# EasyEDA Pro project 第十届农装PCB工程.epro, board 主控板_2024_8
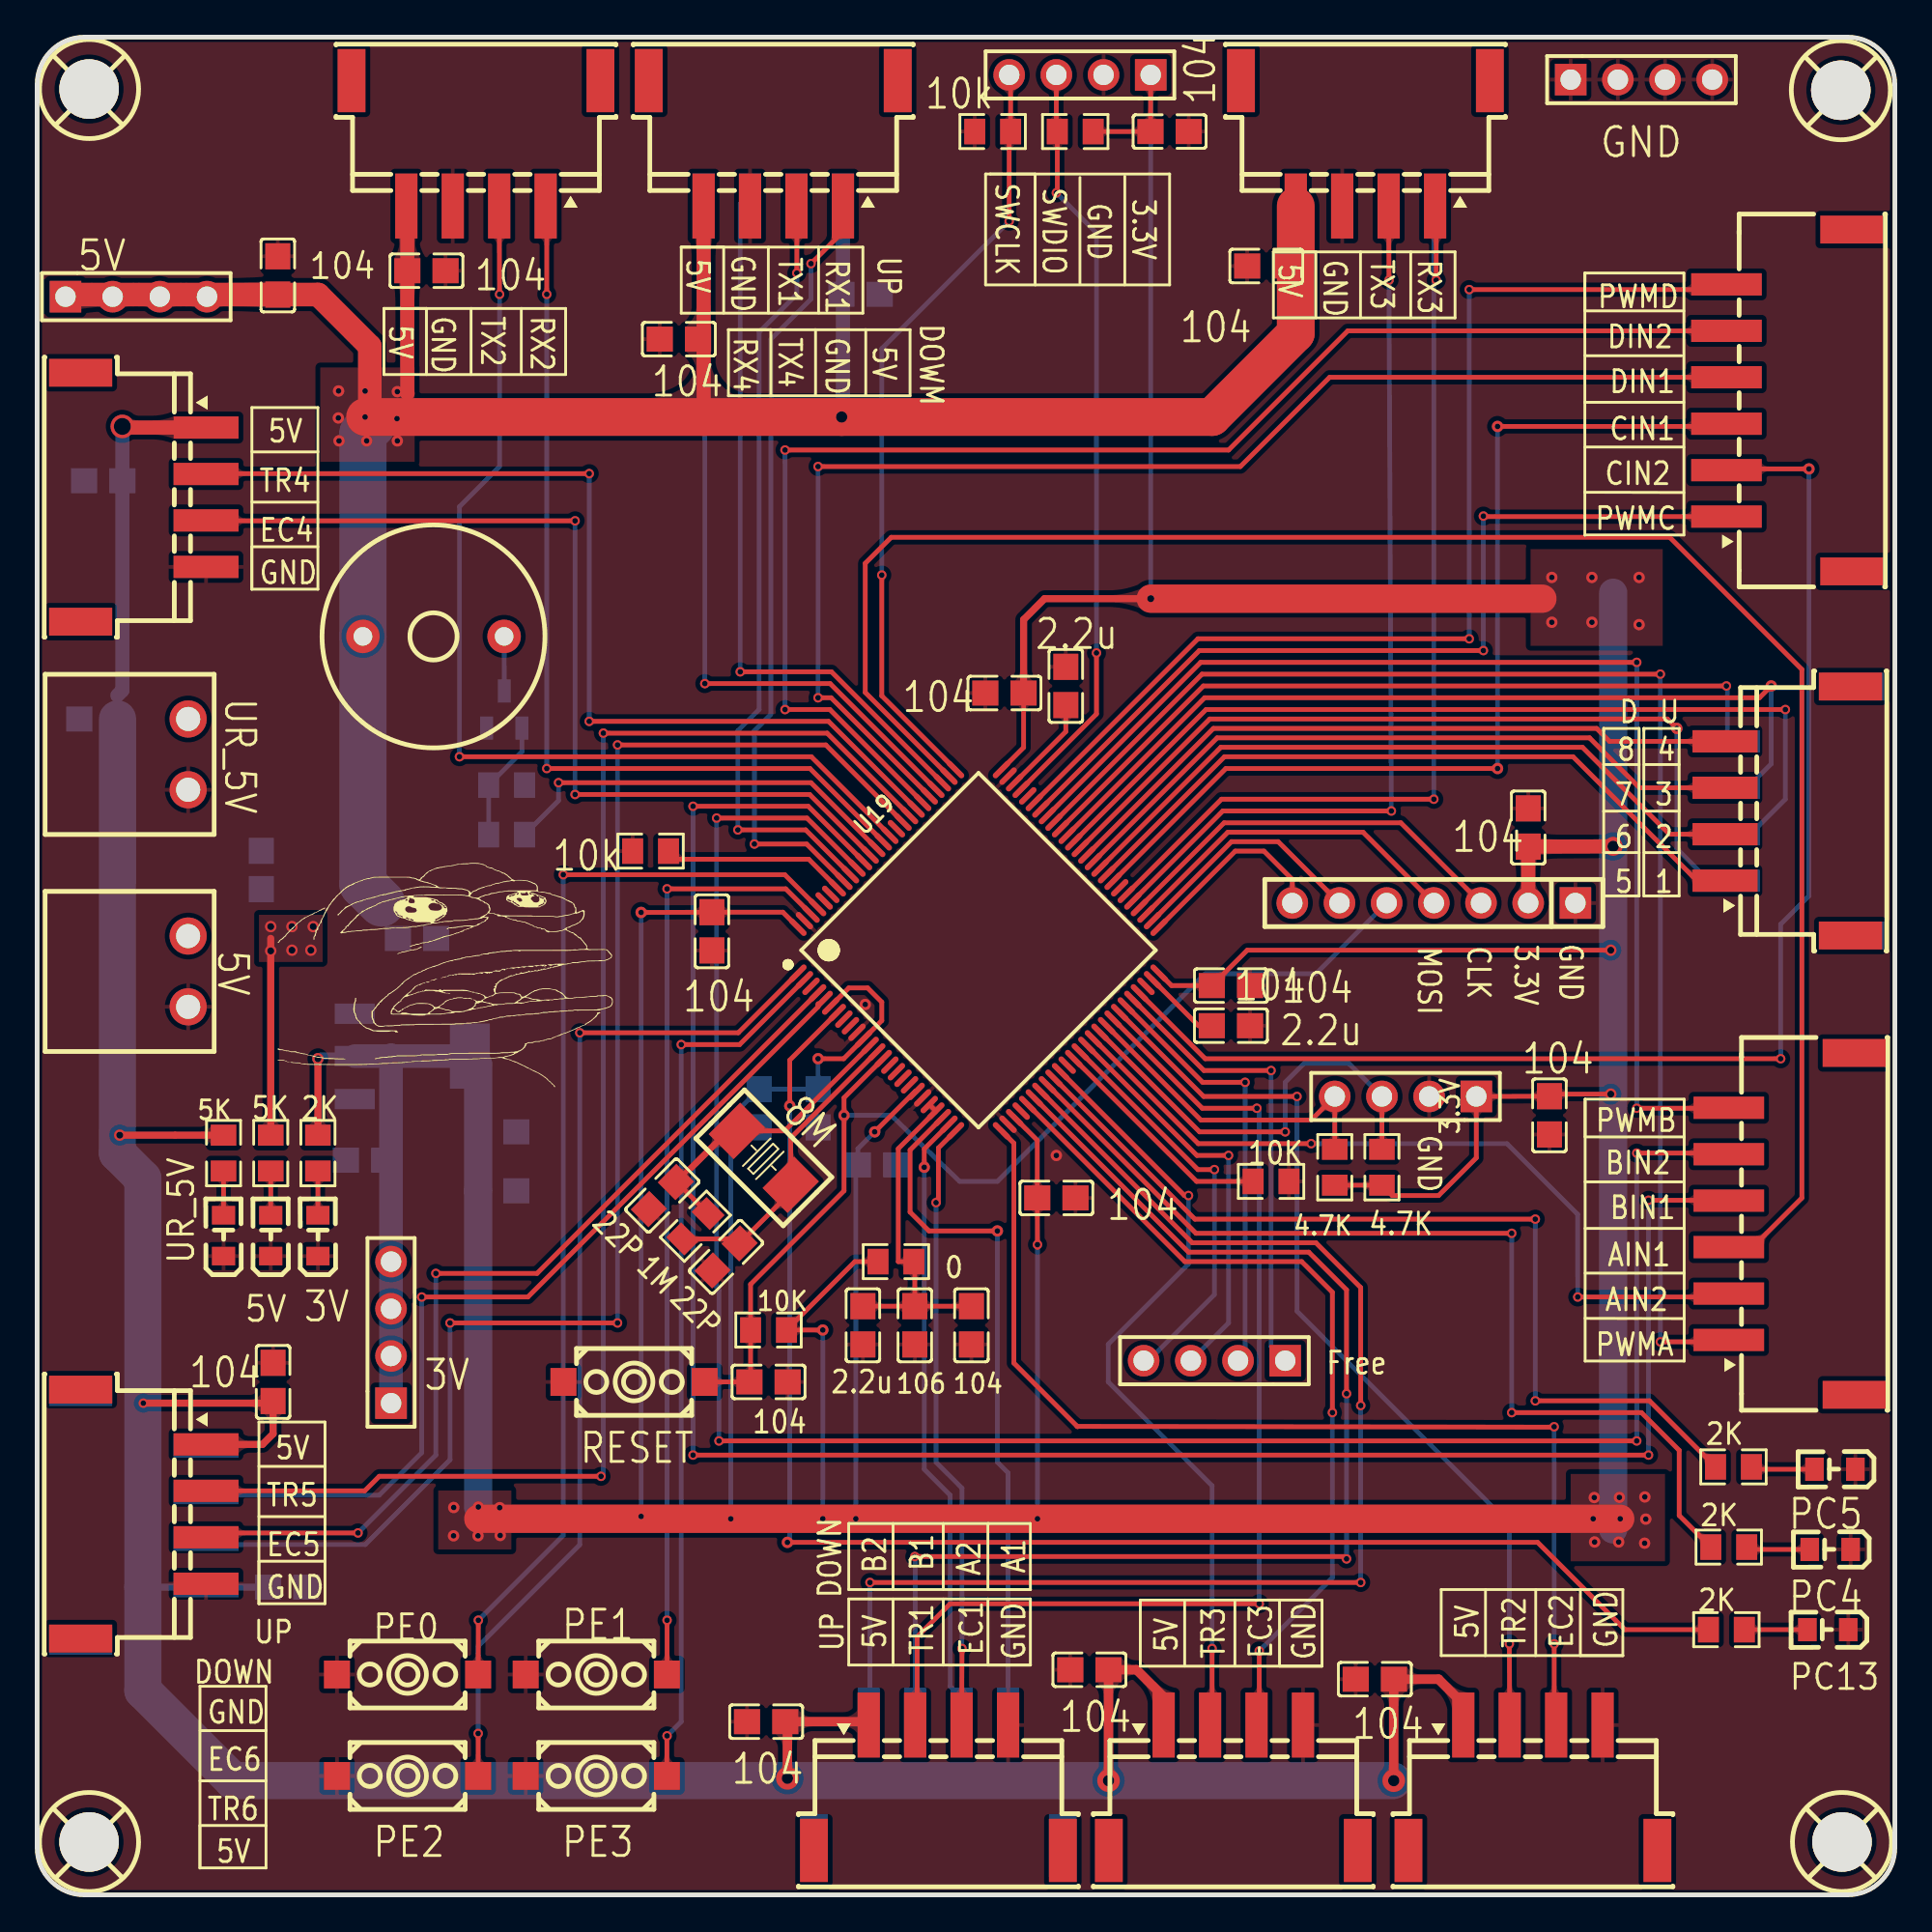
[diagram p7: board, top side]
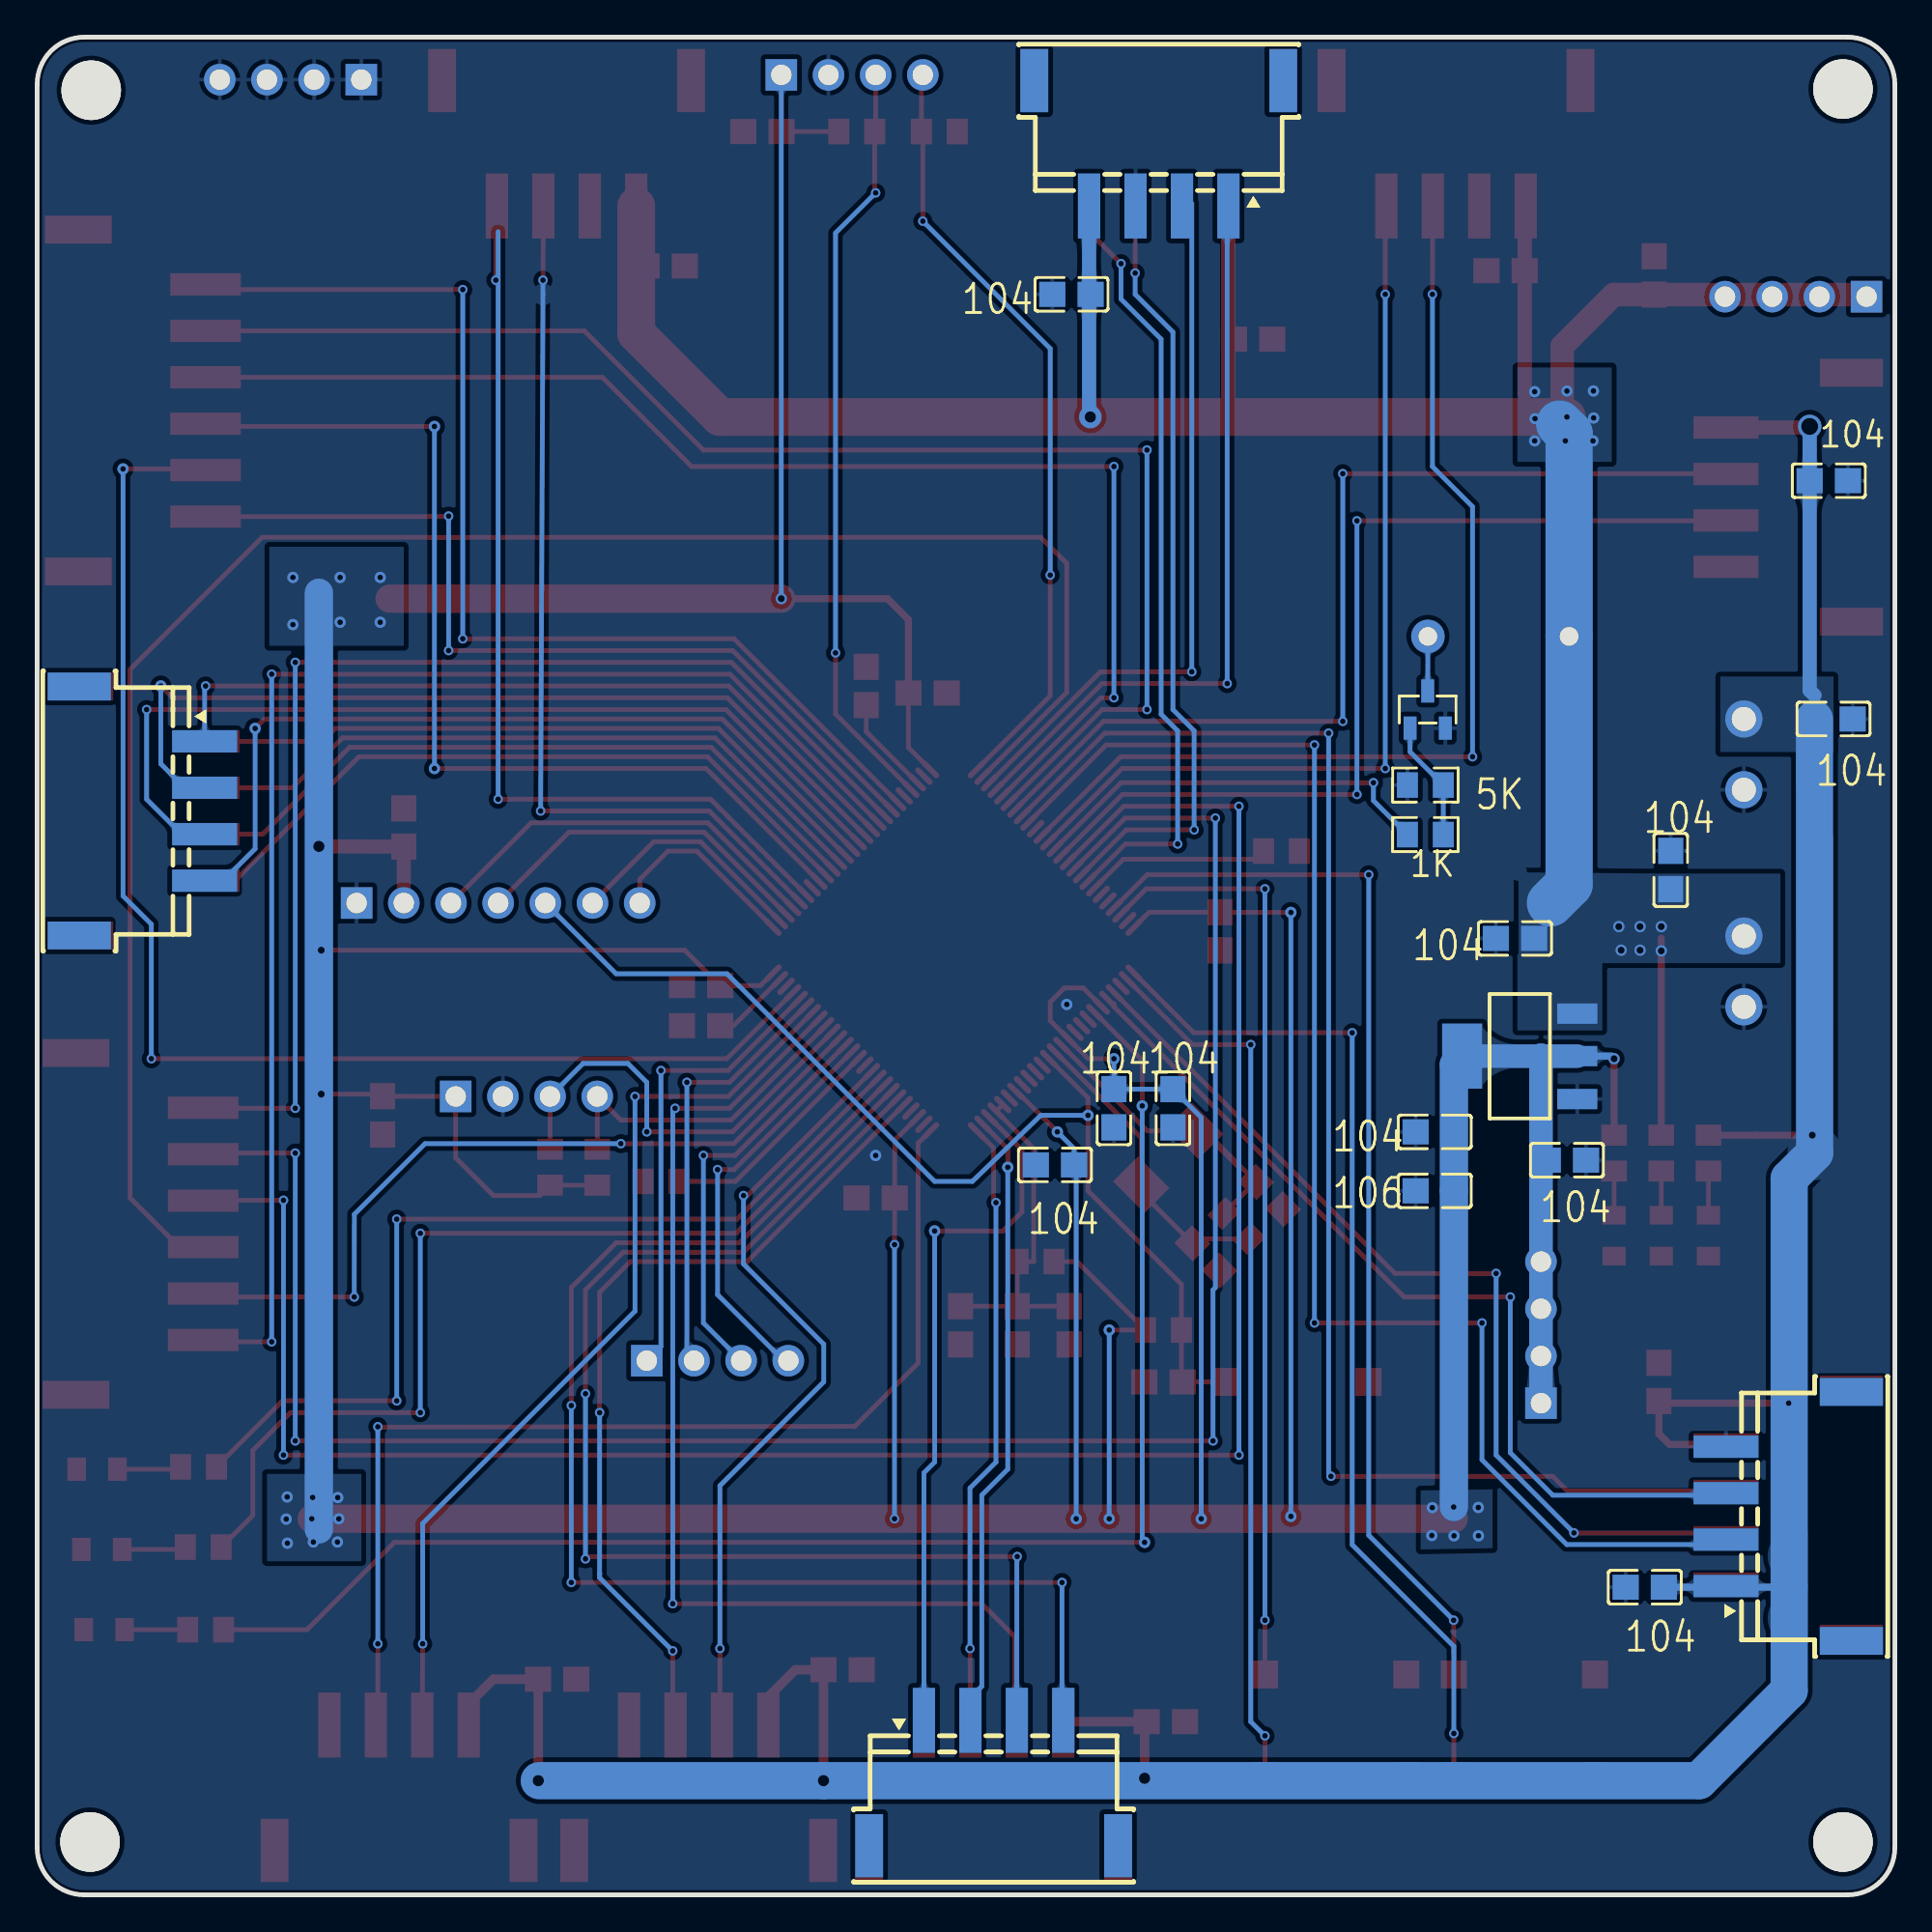
[diagram p8: board, bottom side, seen from below]

Outline 100 x 100 mm; copper layers: Top Layer, Bottom Layer. Coordinates in mm from the lower left corner of the outline.
Outline path: 0,97.46 0,2.54 arc(0.74,0.74) 2.54,0 97.46,0 arc(99.26,0.74) 100,2.54 100,97.46 arc(99.26,99.26) 97.46,100 2.54,100 arc(0.74,99.26) 0,97.46
Stack: Top Layer 0.035mm / Dielectric1 1.51mm FR4 er 4.5 / Bottom Layer 0.035mm

## Design rules (mm)
spacing Default (default): track to track 0.152, other pairs 0 to 0.152
track width Default (default): min 0.254, default 0.254, max 25.4
differential pair differentialPair (default): width min 0.127, default 0.254, max 2.54; gap min 0.152, default 0.152
via Default (default): diameter min 0.508, default 0.508, max 100.025; hole min 0.305, default 0.305, max 59.995
net GND uses gge38070
pour e1360 uses gge38070

## Placement (name value [footprint] x y rotation side)
0  0  [R0805]  46.23 34.09 0 top
1K  1K  [R0805]  25.27 57.07 0 bottom
2.2U  2.2u  [C0805]  44.45 30.66 90 top
2K  -  [R0805]  91.06 18.72 180 top
2K#2  -  [R0805]  90.93 14.28 180 top
2K#3  -  [R0805]  91.31 23.04 180 top
3.3V  826629-4  [HDR-TH_4P-P2.54-V-M-1]  73.66 42.98 180 top
4.7K  4.7K  [R0805]  69.85 39.17 90 top
5K  5K  [R0805]  10.03 39.93 90 top
5V  -  [HDR-TH_4P-P2.54-V-M-1]  5.33 86.03 0 top
5V#2  -  [LED0805-RD_RED]  12.57 35.48 90 top
10K  10K  [R0805]  39.37 30.4 180 top
104  -  [C0805]  50.29 30.66 270 top
104#2  -  [C0805]  12.95 87.17 90 top
104#3  -  [C0805]  3.56 76.12 180 bottom
106  106  [C0805]  47.24 30.66 270 top
BEEP1  TMB12A05  [BUZ-TH_BD12.0-P7.60-D0.6-FD]  21.34 67.74 0 top
C1  104  [C0805]  17.65 39.55 180 bottom
C6  104  [C0805]  42.04 42.34 270 bottom
C7  104  [C0805]  38.86 42.34 270 bottom
C8  104  [C0805]  64.26 48.95 0 top
C9  104  [C0805]  36.32 51.87 270 top
C10  104  [C0805]  52.07 64.69 180 top
C11  104  [C0805]  54.86 37.52 0 top
C12  104  [C0805]  45.21 39.29 0 bottom
C13  104  [C0805]  39.37 27.61 0 top
C14  22p  [C0805]  37.08 34.34 225 top
C15  22p  [C0805]  33.66 37.64 45 top
C16  104  [C0805]  20.45 51.49 0 bottom
C17  106  [C0805]  24.77 37.9 0 bottom
C18  104  [C0805]  24.77 41.07 0 bottom
C19  104  [C0805]  12.06 55.17 90 bottom
C22  104  [C0805]  80.26 57.45 90 top
C23  104  [C0805]  81.41 41.96 270 top
C24  104  [C0805]  60.96 94.92 180 top
C25  104  [C0805]  20.95 87.43 180 top
C26  104  [C0805]  34.54 83.74 0 top
C27  104  [C0805]  66.17 87.68 0 top
C28  104  [C0805]  44.32 86.16 180 bottom
C29  104  [C0805]  39.24 9.32 180 top
C30  104  [C0805]  56.64 12.12 180 top
C31  104  [C0805]  72.01 11.61 180 top
C33  104  [C0805]  13.46 16.56 0 bottom
C34  104  [C0805]  12.7 27.61 90 top
C35  104  [C0805]  3.3 63.3 180 bottom
C36  2.2u  [C0805]  55.37 65.08 90 top
C37  2.2u  [C0805]  64.26 46.79 0 top
CN1  XY2500R-F-3.81-2P  [CONN-TH_XY2500R-F-3.81-2P]  8.13 49.71 270 top
CN3  XY2500R-F-3.81-2P  [CONN-TH_XY2500R-F-3.81-2P]  8.13 61.39 270 top
GND  -  [HDR-TH_4P-P2.54-V-M-1]  86.36 97.71 0 top
GND#2  -  [HDR-TH_7P-P2.54-V-M]  75.18 53.39 180 top
H3  826629-4  [HDR-TH_4P-P2.54-V-M-1]  19.05 30.28 90 top
H5  826629-4  [HDR-TH_4P-P2.54-V-M-1]  56.13 97.97 180 top
H6  826629-4  [HDR-TH_4P-P2.54-V-M-1]  63.37 28.75 180 top
LED2  FC-2012HRK-620D  [LED0805-RD_RED]  15.11 35.48 90 top
LED3  FC-2012HRK-620D  [LED0805-RD_RED]  96.52 18.59 180 top
LED5  FC-2012HRK-620D  [LED0805-RD_RED]  96.77 22.91 180 top
PC13  FC-2012HRK-620D  [LED0805-RD_RED]  96.39 14.28 180 top
PE0  RESET  [KEY-SMD_L6.2-W3.6-LS8.0]  19.94 11.86 180 top
Q1  FHT9014Y-ME  [SOT-23-3_L2.9-W1.3-P1.90-LS2.4-BR]  25.15 63.81 270 bottom
R3  1M  [R0805]  35.43 35.99 225 top
R4  10K  [R0805]  33.02 56.19 0 top
R5  10K  [R0805]  66.42 38.41 180 top
R6  5K  [R0805]  12.57 39.93 90 top
R7  2K  [R0805]  15.11 39.93 90 top
R8  4.7K  [R0805]  72.39 39.17 90 top
R10  10K  [R0805]  51.44 94.92 180 top
R11  10K  [R0805]  55.88 94.92 0 top
R16  10K  [R0805]  25.27 59.74 0 bottom
SW1  RESET  [KEY-SMD_L6.2-W3.6-LS8.0]  32.13 27.61 180 top
SW3  RESET  [KEY-SMD_L6.2-W3.6-LS8.0]  30.1 11.86 180 top
SW4  RESET  [KEY-SMD_L6.2-W3.6-LS8.0]  19.94 6.4 180 top
SW5  RESET  [KEY-SMD_L6.2-W3.6-LS8.0]  30.1 6.4 180 top
TB1  2.54-6PWT  [COMM-SMD_6P-P2.50_SHOUHAN_2.54-6PWT]  94.49 36.12 90 top
TB2  2.54-6PWT  [COMM-SMD_6P-P2.50_SHOUHAN_2.54-6PWT]  94.36 80.44 90 top
TP1  -  [M3螺丝]  2.86 97.14 0 top
TP1#2  -  [M3螺丝]  97.16 97.08 0 top
TP1#3  -  [M3螺丝]  2.86 2.78 0 top
TP1#4  -  [M3螺丝]  97.22 2.78 0 top
U1  AMS1117_3.3  [AMS1117-3.3]  20.19 45.14 180 bottom
U2  Encoder_AB1  [COMM-SMD_4P-P2.50_SHOUHAN_2.54-4PWT]  94.23 58.34 90 top
U3  Encoder_AB1  [COMM-SMD_4P-P2.50_SHOUHAN_2.54-4PWT]  94.36 58.34 270 bottom
U6  Encoder_AB1  [COMM-SMD_4P-P2.50_SHOUHAN_2.54-4PWT]  48.51 6.02 180 bottom
U9  Encoder_AB1  [COMM-SMD_4P-P2.50_SHOUHAN_2.54-4PWT]  39.62 94.28 180 top
U10  Encoder_AB1  [COMM-SMD_4P-P2.50_SHOUHAN_2.54-4PWT]  23.62 94.28 180 top
U11  Encoder_AB1  [COMM-SMD_4P-P2.50_SHOUHAN_2.54-4PWT]  71.5 94.28 180 top
U12  Encoder_AB1  [COMM-SMD_4P-P2.50_SHOUHAN_2.54-4PWT]  39.62 94.28 0 bottom
U13  Encoder_AB1  [COMM-SMD_4P-P2.50_SHOUHAN_2.54-4PWT]  48.51 5.77 0 top
U14  Encoder_AB1  [COMM-SMD_4P-P2.50_SHOUHAN_2.54-4PWT]  80.52 5.77 0 top
U15  Encoder_AB1  [COMM-SMD_4P-P2.50_SHOUHAN_2.54-4PWT]  64.39 5.77 0 top
U16  Encoder_AB1  [COMM-SMD_4P-P2.50_SHOUHAN_2.54-4PWT]  5.72 75.23 270 top
U17  Encoder_AB1  [COMM-SMD_4P-P2.50_SHOUHAN_2.54-4PWT]  5.72 20.37 90 bottom
U18  Encoder_AB1  [COMM-SMD_4P-P2.50_SHOUHAN_2.54-4PWT]  5.72 20.5 270 top
U19  STM32F407VGT6_part  [STM32F407VGT6]  50.67 50.85 45 top
UR_5V  FC-2012HRK-620D  [LED0805-RD_RED]  10.03 35.48 90 top
X1  8MHz  [OSC-SMD_L5.0-W3.2]  39.12 39.67 315 top

## Footprints (pads in the part's own frame, mm; a bottom-side part is the same pattern mirrored in y, then rotated)
AMS1117-3.3
  rect 2.159x1.092 smd: 1(3.099,-2.299) 2(3.099,0.013) 3(3.099,2.299)
  rect 2.159x3.505 smd: 4(-3.099,0.013)
BUZ-TH_BD12.0-P7.60-D0.6-FD
  round 1.8 hole 1: 1(-3.8,0) 2(3.8,0)
C0805
  rect 1.41x1.35 smd: 1(-1.03,0) 2(1.03,0)
COMM-SMD_4P-P2.50_SHOUHAN_2.54-4PWT
  rect 1.2x3.5 smd: 1(-3.75,3.375) 2(-1.25,3.375) 3(1.25,3.375) 4(3.75,3.375)
  rect 1.5x3.4 smd: 5(6.7,-3.375) 6(-6.7,-3.375)
COMM-SMD_6P-P2.50_SHOUHAN_2.54-6PWT
  rect 1.2x3.8 smd: 1(-6.25,3.425) 2(-3.751,3.425) 3(-1.25,3.425) 4(1.25,3.425) 5(3.75,3.425) 6(6.25,3.425)
  rect 1.5x3.6 smd: 7(9.2,-3.425) 8(-9.2,-3.425)
CONN-TH_XY2500R-F-3.81-2P
  round 2 hole 1.3: 1(-1.905,0) 2(1.905,0)
HDR-TH_4P-P2.54-V-M-1
  rect 1.7x1.7 hole 1.1: 1(-3.81,0)
  round 1.7 hole 1.1: 2(-1.27,0) 3(1.27,0) 4(3.81,0)
HDR-TH_7P-P2.54-V-M
  rect 1.7x1.7 hole 1.1: 1(-7.62,0)
  round 1.7 hole 1.1: 2(-5.08,0) 3(-2.54,0) 4(0,0) 5(2.54,0) 6(5.08,0) 7(7.62,0)
KEY-SMD_L6.2-W3.6-LS8.0
  rect 1.4x1.5 smd: 1(-3.8,0) 2(3.8,0)
LED0805-RD_RED
  rect 1x1.25 smd: 1(-1.1,0) 2(1.1,0)
M3螺丝
  round 3.2 hole 3.2: 1(-0.064,0.064)
OSC-SMD_L5.0-W3.2
  rect 1.9x2.4 smd: 1(-2.05,0) 2(2.05,0)
R0805
  rect 1.133x1.377 smd: 1(-0.966,0) 2(0.966,0)
SOT-23-3_L2.9-W1.3-P1.90-LS2.4-BR
  rect 1.25x0.7 smd: 1(1,-0.95) 2(1,0.95) 3(-1,0)
STM32F407VGT6
  oval 1.2x0.3 smd: 1(-7.75,6) 2(-7.75,5.5) 3(-7.75,5) 4(-7.75,4.5) 5(-7.75,4) 6(-7.75,3.5) 7(-7.75,3) 8(-7.75,2.5) 9(-7.75,2) 10(-7.75,1.5) 11(-7.75,1) 12(-7.75,0.5) 13(-7.75,0) 14(-7.75,-0.5) 15(-7.75,-1) 16(-7.75,-1.5) 17(-7.75,-2) 18(-7.75,-2.5) 19(-7.75,-3) 20(-7.75,-3.5) 21(-7.75,-4) 22(-7.75,-4.5) 23(-7.75,-5) 24(-7.75,-5.5) 25(-7.75,-6) 51(7.75,-6) 52(7.75,-5.5) 53(7.75,-5) 54(7.75,-4.5) 55(7.75,-4) 56(7.75,-3.5) 57(7.75,-3) 58(7.75,-2.501) 59(7.75,-2) 60(7.75,-1.5) 61(7.75,-1) 62(7.75,-0.5) 63(7.75,0) 64(7.75,0.5) 65(7.75,1) 66(7.75,1.5) 67(7.75,2) 68(7.75,2.5) 69(7.75,3) 70(7.75,3.5) 71(7.75,4) 72(7.75,4.5) 73(7.75,5) 74(7.75,5.5) 75(7.75,6)
  oval 0.3x1.2 smd: 26(-6,-7.75) 27(-5.5,-7.75) 28(-5,-7.75) 29(-4.5,-7.75) 30(-4,-7.75) 31(-3.5,-7.75) 32(-3,-7.75) 33(-2.5,-7.75) 34(-2,-7.75) 35(-1.5,-7.75) 36(-1,-7.75) 37(-0.5,-7.75) 38(0,-7.75) 39(0.5,-7.75) 40(1,-7.75) 41(1.5,-7.75) 42(2,-7.75) 43(2.501,-7.75) 44(3,-7.75) 45(3.501,-7.75) 46(4,-7.75) 47(4.5,-7.75) 48(5,-7.75) 49(5.5,-7.75) 50(6,-7.75) 76(6,7.75) 77(5.5,7.75) 78(5,7.75) 79(4.5,7.75) 80(4,7.75) 81(3.5,7.75) 82(3,7.75) 83(2.501,7.75) 84(2,7.75) 85(1.5,7.75) 86(1,7.75) 87(0.5,7.75) 88(0,7.75) 89(-0.499,7.75) 90(-1,7.75) 91(-1.5,7.75) 92(-2,7.75) 93(-2.5,7.75) 94(-3,7.75) 95(-3.5,7.75) 96(-4,7.75) 97(-4.5,7.75) 98(-5,7.75) 99(-5.5,7.75) 100(-6,7.75)

## Nets
As in the schematic, except:
GND: 2.2U.1 3.3V.2 5V#2.1 104.2 104#2.2 104#3.2 106.2 C1.2 C6.2 C7.2 C8.2 C9.2 C10.2 C11.2 C12.2 C13.2 C14.2 C15.1 C16.2 C17.2 C18.2 C19.2 C22.2 C23.2 C24.1 C25.1 C26.1 C27.1 C28.1 C29.2 C30.2 C31.2 C33.2 C34.2 C35.2 C36.2 C37.2 CN1.2 CN3.2 GND.1 GND.2 GND.3 GND.4 GND#2.1 H5.2 LED2.1 LED3.1 LED5.1 PC13.1 PE0.2 Q1.2 R4.1 R5.1 R10.2 R16.2 SW1.2 SW3.2 SW4.2 SW5.2 U1.1 U9.3 U10.3 U11.3 U12.3 U13.4 U14.4 U15.4 U16.4 U17.4 U18.4 U19.10 U19.20 U19.27 U19.74 U19.99 UR_5V.1
VCC3V: 0.1 3.3V.1 4.7K.1 10K.1 C1.1 C6.1 C7.1 C8.1 C9.1 C10.1 C11.1 C12.1 C17.1 C18.1 C22.1 C23.1 C24.2 GND#2.2 H3.1 H3.2 H3.3 H3.4 H5.1 R7.2 R8.1 R11.2 U1.2 U1.4 U19.6 U19.11 U19.19 U19.28 U19.50 U19.75 U19.100
VCC5V: 5V.1 5V.2 5V.3 5V.4 104#2.1 BEEP1.1 C16.1 C19.1 C25.2 C26.2 C27.2 C28.2 CN1.1 R6.2 U1.3 U9.4 U10.4 U11.4 U12.4
BEEP: 1K.2 U19.88
C40_2: 0.2 2.2U.2 104.1 106.1 U19.21 U19.22
KEY1: PE0.1 U19.97
LED1: 2K#2.2 U19.7
LED1_2: 5V#2.2 R6.1
LED2: 2K.2 U19.33
LED3: 2K#3.2 U19.34
LED5_2: 2K#3.1 LED5.2
OLED_CLK: GND#2.3 U19.54
OLED_CS: GND#2.7 U19.51
OLED_DC: GND#2.6 U19.52
OLED_MOSI: GND#2.4 U19.53
Q1_1: 1K.1 Q1.1 R16.1
R12_1: 2K.1 LED3.2
R13_1: 2K#2.1 PC13.2
R17_1: 5K.1 UR_5V.2
RESET: 10K.2 C13.1 GND#2.5 SW1.1 U19.14
SCL_9250: 3.3V.3 R8.2 U19.41
SDA_9250: 3.3V.4 4.7K.2 U19.42
ULTRA_5V: 5K.2 104#3.1 C29.1 C30.1 C31.1 C33.1 C34.1 C35.1 CN3.1 U13.1 U14.1 U15.1 U16.1 U17.1 U18.1

Pads without a net: TP1 1; TP1#2 1; TP1#3 1; TP1#4 1

## Via types
v1: diameter 0.61, hole 0.305, Top Layer to Bottom Layer, 50 vias
v2: diameter 1.219, hole 0.61, Top Layer to Bottom Layer, 4 vias
v3: diameter 0.61, hole 0.381, Top Layer to Bottom Layer, 11 vias
v4: diameter 0.508, hole 0.305, Top Layer to Bottom Layer, 94 vias
v5: diameter 1.27, hole 0.914, Top Layer to Bottom Layer, 1 via
v6: diameter 1.016, hole 0.61, Top Layer to Bottom Layer, 1 via

## Routing (per net, layer and track width the routed paths; a pad name or vN(x,y) marks a point on that pad's centre or on a via; arc(x,y) is an arc through that point)
GND:
  vias: v1(44.58,47.93) v1(54.86,39.8)
VCC3V: length 435.2
  Top Layer w0.254: U19.100 40.14,52.9 C9.1 v1(32.51,52.88) ; 56.84,94.92 59.93,94.92 H5.1 ; v1(42.29,30.4) 10K.1 44.02,34.09 45.26,34.09 ; 4.7K.1 R8.1 72.95,37.64 75.44,37.64 77.47,39.67 3.3V.1 81.41,42.99 81.41,43.1 v3(84.71,43.1) ; C10.1 53.1,61.76 U19.75 ; U19.6 43.69,48.82 44.7,48.82 45.47,48.06 45.47,47.06 U19.11 43.42,45.01 v1(42.04,45.01) ; 63.23,48.95 65.14,50.85 v3(84.71,50.85) ; C8.1 61.06,48.95 U19.50 ; v1(45.09,41.07) 47.27,43.26 47.31,43.26 ; U19.28 53.84,40.62 53.84,37.52 53.85,34.85
  Top Layer w0.381: C10.1 53.1,68.64 54.23,69.77 v3(59.94,69.77) ; 15.11,40.89 v3(15.11,45.01)
  Top Layer w0.762: 84.84,56.55 v6(84.84,56.44) C22.1 GND#2.2
  Top Layer w1.524: 81.03,69.77 v3(59.94,69.77) ; 23.75,20.24 v1(85.22,20.24)
  Bottom Layer w0.254: v3(59.94,69.77) H5.1 ; v1(42.04,45.01) 42.04,43.37 38.86,43.37 37.34,41.85 v1(37.34,20.24) ; 32.51,53.01 32.51,20.5 ; 53.85,35.1 53.85,20.22 ; v1(44.07,20.24) 44.07,39.29 44.18,39.29 44.18,40.17 v1(45.09,41.07) ; v1(42.29,30.4) v1(42.29,20.24)
  Bottom Layer w0.381: v3(15.11,45.01) 15.25,45.15 U1.2
  Bottom Layer w1.27: U1.2 U1.4 ; 19.05,26.47 19.05,45.2
  Bottom Layer w1.524: 84.84,19.67 84.84,70.09 ; U1.4 23.74,44.7 23.74,20.88
  vias: v1(22.42,20.85) v1(22.41,19.33) v1(23.75,20.88) v1(23.73,19.33) v1(24.9,20.84) v1(24.93,19.35) v1(32.51,20.37) v1(81.53,70.92) v1(81.53,68.5) v1(83.69,70.92) v1(83.69,68.5) v1(83.82,21.39) v1(83.76,20.24) v1(83.84,18.99) v1(85.13,18.99) v1(85.17,21.39) v1(86.23,70.92) v1(86.23,68.38) v1(86.54,21.42) v1(86.53,18.93) v1(86.59,20.23) v4(53.85,35) v4(53.85,20.24)
VCC5V: length 149.4
  Top Layer w0.381: 12.57,40.89 12.57,51.49
  Top Layer w0.762: 19.94,80.82 19.92,80.84 C25.2 19.92,90.86 U10.4 ; 35.88,90.91 35.88,79.55
  Top Layer w1.27: 1.4,86.03 1.51,86.14 104#2.1 15.13,86.14 17.91,83.36 17.91,80.44
  Top Layer w2.032: v1(17.65,79.55) v2(43.31,79.55) 63.25,79.55 67.75,84.06 U11.4
  Bottom Layer w0.762: v2(43.31,79.55) 43.37,79.62 43.37,91.04
  Bottom Layer w2.54: 18.04,79.17 17.54,78.66 BEEP1.1 17.54,54.4 18.54,53.39
  vias: v1(16.23,80.95) v1(16.21,79.5) v1(16.25,78.27) v1(17.65,80.95) v1(17.74,78.27) v1(19.39,80.92) v1(19.37,79.47) v1(19.39,78.27) v3(12.57,52.12) v3(12.57,50.81) v3(13.72,52.12) v3(13.72,50.85) v3(14.73,50.85) v3(14.86,52.12)
AIN1: length 100.6
  Top Layer w0.254: 91.32,34.87 91.32,34.98 92.46,34.98 95,37.52 95,65.96 87.88,73.08 45.97,73.08 44.58,71.68 44.58,64.72 49.08,60.22
AIN2: length 42.9
  Top Layer w0.254: U19.40 62.5,40.44 v4(68.58,40.44) ; 91.32,32.37 91.13,32.18 v4(82.93,32.18)
  Bottom Layer w0.254: v4(82.93,32.18) 82.93,36.63 79.12,40.44 v4(68.58,40.44)
BEEP: length 22.1
  Top Layer w0.254: U19.88 41.66,59.87 v4(28.07,59.87)
  Bottom Layer w0.254: v4(28.07,59.87) 28.07,58.9 1K.2
BEEP1_2: length 2.9
  Bottom Layer w0.254: BEEP1.2 25.15,64.81
BIN1: length 115.1
  Top Layer w0.254: 91.25,37.38 91.24,37.39 v4(86.74,37.39) ; U19.90 41.51,58.6 v4(35.31,58.6) ; v4(35.31,23.67) v4(86.74,23.67)
  Bottom Layer w0.254: v4(35.31,23.67) v4(35.31,58.6) ; 86.61,37.39 v4(86.74,37.39) v4(86.74,23.67)
BIN2: length 112.4
  Top Layer w0.254: v4(36.58,57.96) 41.44,57.96 U19.91 ; v4(36.7,24.44) v4(86.11,24.44) ; 91.32,39.87 91.26,39.93 v4(86.11,39.93)
  Bottom Layer w0.254: v4(86.11,24.44) v4(86.11,39.93) ; v4(36.7,24.44) 36.7,32.56 36.58,32.69 v4(36.58,57.96)
BOOT0: length 9.9
  Top Layer w0.254: 43.07,54.21 41.53,55.75 34.09,55.75 34.09,56
BOOT1: length 12.4
  Top Layer w0.254: 65.46,38.41 62.41,38.41 55.8,45.02
C36_1: length 5.3
  Top Layer w0.254: C36.1 55.37,62.62 U19.73
C37_1: length 4.2
  Top Layer w0.254: 63.23,46.79 62.51,46.79 60.04,49.26
C40_2: length 18.5
  Top Layer w0.254: 47.24,31.69 47.24,34.04 47.19,34.09 46.35,34.09 46.35,40.17 48.37,42.19 48.02,42.54 ; 2.2U.2 50.29,31.69
CIN1: length 54.1
  Top Layer w0.254: U19.58 63.99,60.63 v1(78.61,60.63) ; 91.06,79.19 90.92,79.05 v1(78.61,79.05)
  Bottom Layer w0.254: v1(78.61,79.05) v1(78.61,60.63)
CIN2: length 72.7
  Top Layer w0.254: v1(95.38,76.76) 91.13,76.76 91.06,76.69 ; 59.33,48.55 62.88,45.01 v4(93.85,45.01)
  Bottom Layer w0.254: v1(95.38,76.76) 95.38,53.77 93.85,52.25 v4(93.85,45.01)
DIN1: length 71.6
  Top Layer w0.254: 48.02,59.16 42.74,64.44 v4(42.04,64.44) ; v4(42.04,76.89) 64.77,76.89 69.58,81.69 91.06,81.69
  Bottom Layer w0.254: 42.04,64.5 v4(42.04,76.89)
DIN2: length 77
  Top Layer w0.254: v4(40.26,77.78) 64.13,77.78 70.55,84.19 91.06,84.19 ; 47.75,58.72 42.67,63.81 v4(40.26,63.81)
  Bottom Layer w0.254: v4(40.26,63.81) v4(40.26,77.78)
ECHO1: length 32.8
  Top Layer w0.254: U19.25 48.51,40.21 48.51,37.26 v4(48.39,37.26) ; 49.76,9.4 v4(49.78,13.26)
  Bottom Layer w0.254: v4(48.39,37.26) 48.39,23.29 49.78,21.9 v4(49.78,13.26)
ECHO2: length 59.2
  Top Layer w0.254: v4(81.66,13.51) 81.66,9.5 81.77,9.4 ; U19.26 52.58,40.46 52.58,28.63 56.01,25.2 ; 81.68,25.18 55.99,25.22
  Bottom Layer w0.254: v4(81.66,13.51) v4(81.66,25.2)
ECHO3: length 45.4
  Top Layer w0.254: U19.30 61.78,34.09 68.07,34.09 69.72,32.44 v4(69.72,25.96) ; v4(65.79,13.13) 65.79,9.54 65.64,9.4
  Bottom Layer w0.254: 69.72,17.32 69.72,17.2 ; 69.72,17.32 69.72,17.07 v4(65.79,13.13) ; 69.72,17.32 v4(69.72,25.96)
ECHO4: length 52
  Top Layer w0.254: v4(28.96,73.97) 8.98,73.97 8.96,73.99 ; v4(28.96,59.23) 41.58,59.23 44.84,55.98
  Bottom Layer w0.254: v4(28.96,73.97) v4(28.96,59.23)
ECHO5: length 51.2
  Top Layer w0.254: 42.01,48.55 26.91,33.45 v4(21.46,33.45) ; v4(17.27,19.48) 8.94,19.48 8.71,19.25
  Bottom Layer w0.254: v4(21.46,33.45) 21.46,23.67 v4(17.27,19.48)
ECHO6: length 49.7
  Top Layer w0.254: 42.04,47.97 42.04,47.8 26.42,32.18 v4(20.7,32.18)
  Bottom Layer w0.254: 8.33,21.51 18.42,21.51 20.7,23.8 v4(20.7,32.18)
ENCOA1: length 37.5
  Top Layer w0.254: v1(51.69,35.74) 48.01,35.74 46.99,36.75 46.99,40.1 U19.23
  Bottom Layer w0.254: v1(51.69,35.74) 51.69,23.29 52.26,22.72 U6.1
ENCOA2: length 33.5
  Top Layer w0.254: v1(47.75,39.17) 47.75,40.15 49.08,41.48
  Bottom Layer w0.254: v1(47.75,39.17) 47.75,22.91 49.15,21.51 49.15,11.23 49.76,10.61 U6.2
ENCOB1: length 67.7
  Top Layer w0.254: v4(70.49,18.09) 70.36,18.21 v4(47.24,18.21) ; v4(70.49,26.97) 70.49,32.56 68.45,34.59 61.98,34.59 U19.31
  Bottom Layer w0.254: v4(70.49,18.09) v4(70.49,26.97) ; U6.3 47.26,18.19 v4(47.24,18.21)
ENCOB2: length 71.3
  Top Layer w0.254: v4(71.25,26.34) 71.25,32.69 68.83,35.1 62.18,35.1 54.03,43.25 ; v4(44.83,16.81) v4(71.25,16.81)
  Bottom Layer w0.254: v4(44.83,16.81) 44.83,9.46 U6.4 ; v4(71.25,26.34) v4(71.25,16.81)
KEY1: length 59.4
  Top Layer w0.254: 42.01,53.15 40.24,54.92 v4(28.32,54.92) ; 23.74,11.86 v4(23.75,14.78)
  Bottom Layer w0.254: v4(28.32,54.92) 28.32,19.35 v4(23.75,14.78)
KEY2: length 50.6
  Top Layer w0.254: U19.98 40.3,54.15 v4(33.91,54.15) ; 33.91,11.86 v4(33.91,14.78)
  Bottom Layer w0.254: v4(33.91,14.78) v4(33.91,54.15)
KEY3: length 55.2
  Top Layer w0.254: 23.75,8.69 v4(23.74,8.69) 23.74,6.4 ; U19.1 37.74,46.41 v4(29.21,46.41)
  Bottom Layer w0.254: v4(23.74,8.69) 23.74,13.38 29.21,18.85 29.21,46.28
KEY4: length 47.8
  Top Layer w0.254: v4(33.91,8.56) 33.9,8.55 SW5.1 ; U19.2 37.82,45.77 v4(34.67,45.77)
  Bottom Layer w0.254: v4(34.67,45.77) 34.67,9.32 v4(33.91,8.56)
LED1: length 81.2
  Top Layer w0.254: U19.7 40.51,44.93 v1(40.51,42.47) ; v1(40.39,18.97) 80.77,18.97 85.47,14.28 89.97,14.28
  Bottom Layer w0.254: v1(40.39,18.97) 40.51,19.1 v1(40.51,42.47)
LED1_2: length 2.4
  Top Layer w0.254: 5V#2.2 R6.1
LED2: length 53.7
  Top Layer w0.254: 90.09,18.72 88.39,20.42 88.39,23.93 86.36,25.96 v4(79.38,25.96) ; v4(79.38,35.61) 62.38,35.61 U19.33
  Bottom Layer w0.254: v4(79.38,35.61) v4(79.38,25.96)
LED2_2: length 2.4
  Top Layer w0.254: LED2.2 R7.1
LED3: length 50
  Top Layer w0.254: v4(80.65,36.37) 62.32,36.37 54.74,43.96 ; 90.35,23.04 86.79,26.59 v4(80.65,26.59)
  Bottom Layer w0.254: v4(80.65,26.59) v4(80.65,36.37)
LED5_2: length 3.4
  Top Layer w0.254: 92.28,23.04 92.41,22.91 LED5.2
OLED_CLK: length 22.1
  Top Layer w0.254: GND#2.3 73.41,57.71 63.89,57.71 59.33,53.15
OLED_CS: length 10.8
  Top Layer w0.254: GND#2.7 67.56,54.66 66.04,56.19 64.49,56.19 U19.51
OLED_DC: length 13.2
  Top Layer w0.254: 60.04,52.44 64.29,56.69 66.8,56.69 GND#2.6
OLED_MOSI: length 18.9
  Top Layer w0.254: 59.69,52.8 64.09,57.2 71.37,57.2 GND#2.4
OSC_IN: length 18.3
  Top Layer w0.254: 35.23,39.09 37.26,41.13 40.24,41.13 44.84,45.73 ; 34.42,38.37 R3.1 ; 36.88,40.87 C15.2
OSC_OUT: length 16.5
  Top Layer w0.254: R3.2 37.57,35.31 C14.1 40.57,37.82 40.57,40.74 45.19,45.37
PIN_FREE1: length 21.9
  Top Layer w0.254: 56.15,45.37 62.49,39.04 v4(63.37,39.04)
  Bottom Layer w0.254: H6.4 59.82,28.75 63.37,32.31 v4(63.37,39.04)
PIN_FREE2: length 22
  Top Layer w0.254: 56.51,45.73 62.43,39.8 v4(64.13,39.8)
  Bottom Layer w0.254: 62.1,28.75 64.13,30.78 v4(64.13,39.8)
PIN_FREE3: length 23.5
  Top Layer w0.254: U19.45 62.74,43.74 v4(65.02,43.74)
  Bottom Layer w0.254: v4(65.02,43.74) 65.02,28.75 H6.2
PIN_FREE4: length 25
  Top Layer w0.254: U19.46 62.81,44.37 v4(66.42,44.37)
  Bottom Layer w0.254: v4(66.42,44.37) 66.42,29.51 H6.1
PWMA: length 75.9
  Top Layer w0.254: 91.32,29.87 91.32,29.77 v4(87.38,29.77) ; v4(87.38,65.71) 62.71,65.71 54.74,57.74
  Bottom Layer w0.254: v4(87.38,65.71) v4(87.38,29.77)
PWMB: length 64.4
  Top Layer w0.254: v4(86.11,42.34) 91.29,42.34 91.32,42.37 ; U19.68 62.63,66.34 v4(86.11,66.34)
  Bottom Layer w0.254: 86.11,42.41 86.11,66.41
PWMC: length 47.8
  Top Layer w0.254: v4(77.85,66.98) 62.56,66.98 U19.69 ; 91.06,74.19 77.88,74.19 v4(77.85,74.22)
  Bottom Layer w0.254: v4(77.85,66.98) v4(77.85,74.22)
PWMD: length 59.9
  Top Layer w0.254: v4(77.09,67.61) 62.49,67.61 U19.70 ; 91.06,86.69 90.78,86.41 v4(77.09,86.41)
  Bottom Layer w0.254: 77.09,86.54 77.09,67.74
Q1_1: length 6.5
  Bottom Layer w0.254: Q1.1 26.1,61.53 R16.1 1K.1
R12_1: length 3.4
  Top Layer w0.254: LED3.2 92.15,18.59 2K.1
R13_1: length 3.4
  Top Layer w0.254: 91.9,14.28 PC13.2
R17_1: length 2.4
  Top Layer w0.254: UR_5V.2 5K.1
RESET: length 59.7
  Top Layer w0.254: 45.55,45.02 43.43,42.91 43.43,37.9 38.41,32.87 10K.2 38.41,27.67 38.34,27.61 SW1.1
  Bottom Layer w0.254: GND#2.5 68.83,49.58 62.87,49.58 51.69,38.41 49.66,38.41 45.97,41.96 v1(43.43,41.96)
RX1: length 42
  Top Layer w0.254: v4(41.66,87.81) 43.37,89.53 43.37,90.91 ; 43.42,54.56 41.42,56.57 v4(38.61,56.57)
  Bottom Layer w0.254: v4(38.61,56.57) 38.61,62.66 39.5,63.55 39.5,83.74 41.66,85.9 v4(41.66,87.81)
RX2: length 50.1
  Top Layer w0.254: v4(27.43,86.16) 27.43,90.85 U10.1 ; 45.55,56.69 41.6,60.63 v4(27.43,60.63)
  Bottom Layer w0.254: v4(27.43,86.16) v4(27.43,60.63)
RX3: length 53.2
  Top Layer w0.254: v4(75.18,58.98) 63.75,58.98 U19.56 ; 75.25,90.91 75.31,90.85 v4(75.31,86.92)
  Bottom Layer w0.254: 75.18,89.52 v4(75.18,58.98)
RX4: length 40.7
  Top Layer w0.254: v4(35.94,65.2) 42.68,65.2 48.37,59.51
  Bottom Layer w0.254: v4(35.94,65.2) 35.94,91.04 35.88,91.04
SCL_9250: length 24.1
  Top Layer w0.254: U19.41 62.57,41.07 v4(67.18,41.07) ; 3.3V.3 R8.2
  Bottom Layer w0.254: v4(67.18,41.07) 67.18,43.74 68.2,44.75 70.61,44.75 3.3V.3
SDA_9250: length 17.8
  Top Layer w0.254: 57.57,46.78 62.64,41.71 68.58,41.71 3.3V.4 4.7K.2
STEER1: length 38.8
  Top Layer w0.254: 57.57,54.92 63.91,61.27 82.68,61.27 89.35,54.59 90.99,54.59
STEER2: length 38.4
  Top Layer w0.254: 90.99,57.09 87.86,57.09 83.19,61.77 63.72,61.77 U19.60
STEER3: length 38
  Top Layer w0.254: 90.99,59.59 86.25,59.59 83.57,62.28 63.52,62.28 U19.61
STEER4: length 37.6
  Top Layer w0.254: 56.51,55.98 63.32,62.79 83.95,62.79 84.64,62.09 90.99,62.09
STEER5: length 45.3
  Top Layer w0.254: v1(88.26,62.79) 87.76,63.3 63.12,63.3 56.01,56.19
  Bottom Layer w0.254: 90.99,54.59 89.98,54.59 88.26,56.31 v1(88.26,62.79)
STEER6: length 50
  Top Layer w0.254: 55.8,56.69 62.92,63.81 v4(94.11,63.81)
  Bottom Layer w0.254: v4(94.11,63.81) 94.11,58.98 92.22,57.09 U3.3
STEER7: length 48.3
  Top Layer w0.254: v1(93.34,65.08) 92.71,64.44 62.85,64.44 U19.65
  Bottom Layer w0.254: U3.2 92.05,59.59 93.34,60.88 v1(93.34,65.08)
STEER8: length 42
  Top Layer w0.254: U19.66 62.78,65.08 v4(90.93,65.08)
  Bottom Layer w0.254: v4(90.93,65.08) 90.99,65.02 90.99,62.09
SWCLK: length 42.1
  Top Layer w0.254: H5.4 52.4,97.89 R10.1 52.32,94.92 v4(52.32,90.09) ; 45.47,70.92 v4(45.47,71.04) 45.47,64.54 U19.76
  Bottom Layer w0.254: v4(52.32,90.09) 45.47,83.24 v4(45.47,71.04)
SWDIO: length 41.1
  Top Layer w0.254: 52.97,59.51 57.02,63.57 v4(57.02,66.85) ; v4(54.86,91.62) 54.91,91.67 54.91,94.92 54.86,94.97 H5.3
  Bottom Layer w0.254: v4(54.86,91.62) 57.02,89.46 v4(57.02,66.85)
TRIG1: length 60.3
  Top Layer w0.254: v4(65.79,15.67) 49.15,15.67 47.37,13.89 47.37,9.5 47.26,9.4 ; U19.43 62.72,42.34 v4(65.66,42.34)
  Bottom Layer w0.254: 65.91,15.61 65.79,15.74 65.79,42.34 v4(65.66,42.34)
TRIG2: length 49.7
  Top Layer w0.254: 58.28,47.49 62.79,42.98 v4(67.82,42.98) ; v4(79.25,13.51) 79.27,9.4
  Bottom Layer w0.254: v4(67.82,42.98) 67.82,31.42 79.25,19.99 v4(79.25,13.51)
TRIG3: length 42.1
  Top Layer w0.254: v4(61.98,37.64) 61.76,37.64 U19.35 ; v4(63.25,13.26) 63.25,9.4 63.14,9.4
  Bottom Layer w0.254: v4(61.98,37.64) 61.98,33.96 57.66,29.64 57.66,27.61 63.25,22.02 v4(63.25,13.26)
TRIG4: length 53.6
  Top Layer w0.254: 47.31,58.45 42.6,63.17 v4(29.72,63.17) ; v4(29.72,76.5) 8.98,76.5 8.96,76.48
  Bottom Layer w0.254: v4(29.72,76.5) v4(29.72,63.17)
TRIG5: length 80.3
  Top Layer w0.254: v4(30.48,62.53) 42.52,62.53 46.96,58.1 ; 8.71,21.75 17.63,21.75 18.42,22.53 v4(30.35,22.53)
  Bottom Layer w0.254: v4(30.35,22.53) 30.48,22.66 v4(30.48,62.53)
TRIG6: length 80.5
  Top Layer w0.254: 46.61,57.74 42.45,61.9 v4(31.24,61.9) ; v4(22.22,30.78) v4(31.24,30.78)
  Bottom Layer w0.254: 8.25,18.86 17.66,18.86 22.22,23.42 v4(22.22,30.78) ; v4(31.24,30.78) v4(31.24,61.9)
TX1: length 42
  Top Layer w0.254: v4(37.72,57.33) 41.37,57.33 43.78,54.92 ; v4(40.89,87.3) 40.89,90.89 U9.2
  Bottom Layer w0.254: v4(37.72,57.33) 37.72,62.66 38.86,63.81 38.86,84.12 40.89,86.16 v4(40.89,87.3)
TX2: length 55.5
  Top Layer w0.254: v4(22.73,61.27) 41.67,61.27 U19.86 ; U10.2 v4(24.89,86.16)
  Bottom Layer w0.254: v4(24.89,86.16) 24.89,76.89 22.73,74.73 v4(22.73,61.27)
TX3: length 48.6
  Top Layer w0.254: 72.9,58.47 v4(72.9,58.34) 63.82,58.34 58.98,53.5 ; 72.75,90.91 v4(72.77,86.92)
  Bottom Layer w0.254: v4(72.9,58.34) 72.77,86.16 v4(72.77,86.92)
TX4: length 39.1
  Top Layer w0.254: v4(37.85,65.84) 42.76,65.84 U19.78
  Bottom Layer w0.254: v4(37.85,65.84) 37.85,91.04 38.35,91.04
ULTRA_5V: length 196
  Top Layer w0.381: 4.44,40.89 10.03,40.89 ; 8.71,24.25 12.13,24.25 12.7,24.82 12.7,26.58 12.59,26.47 v4(5.72,26.47)
  Top Layer w0.508: 40.39,9.45 v2(40.39,6.27) ; 57.67,6.15 57.67,12.12 59.18,12.12 60.64,10.66 60.64,9.4 ; 73.03,11.5 v2(73.03,6.15) ; 44.69,9.32 C29.1 ; C31.1 75.44,11.61 76.77,10.28 U14.1
  Top Layer w0.762: 4.58,79.05 4.65,78.98 8.96,78.98
  Bottom Layer w0.381: 5.36,16.56 12.43,16.56
  Bottom Layer w0.762: 4.58,79.05 4.58,64.83 4.32,64.57
  Bottom Layer w2: 72.97,6.15 v2(57.67,6.15) 10.54,6.15 5.69,11 5.69,38.56 4.32,39.93 4.33,63.3
  vias: v3(4.44,40.89) v5(4.59,79.05)

## Copper pours and planes (outline as drawn; the poured copper is in the pictures)
GND on Top Layer: 0.13,-0.08 99.82,-0.08 99.95,0.05 99.95,100 99.82,100.13 0.13,100.13
GND on Bottom Layer: 0.13,100.13 0.13,-0.08 99.95,-0.08 99.95,100.13
VCC3V on Top Layer: 82.55,22.66 87.63,22.66 87.63,17.96 82.55,17.96
VCC3V on Top Layer: 21.59,21.77 25.53,21.77 25.53,18.59 21.59,18.59
VCC3V on Top Layer: 80.39,72.44 87.5,72.44 87.5,67.23 80.39,67.23
VCC3V on Bottom Layer: 21.65,21.83 25.53,21.83 25.53,18.59 21.65,18.59
VCC3V on Bottom Layer: 80.26,72.57 87.5,72.57 87.5,67.23 80.26,67.23
VCC3V on Bottom Layer: 82.55,22.66 87.63,22.66 87.63,17.96 82.55,17.96
VCC5V on Top Layer: 15.24,82.22 20.32,82.22 20.32,77.14 15.24,77.14
VCC5V on Top Layer: 11.94,52.76 15.37,52.76 15.37,50.22 11.94,50.22
VCC5V on Bottom Layer: 6.16,55.04 20.26,55.04 20.26,50.15 6.16,50.15
VCC5V on Bottom Layer: 15.75,50.72 20.32,50.72 20.32,46.53 15.75,46.53
VCC5V on Bottom Layer: 15.24,82.22 20.32,82.22 20.32,77.14 15.24,77.14
ULTRA_5V on Bottom Layer: 3.3,65.58 9.4,65.58 9.4,61.52 3.3,61.52

Small or netless copper shapes (teardrops, artwork), in the pictures only: 363 on Top Layer, 178 on Bottom Layer

## Text on the board
Bottom Silkscreen Layer: 104 | 5K | 106
Top Silkscreen Layer: 7 | 6 | 5 | 8 | D | 3 | 2 | 1 | 4 | U | 5K | 2K | 104 | 10K | 4.7K | DOWN | GND | EC6 | TR6 | 5V | UP | TR4 | EC4 | TR5 | EC5 | 2.2u | Free | PWMC | PWMA | PWMB | PWMD | CIN2 | BIN2 | AIN2 | DIN2 | AIN1 | DIN1 | CIN1 | BIN1 | B2 | B1 | TR1 | A2 | EC1 | A1 | TR3 | EC3 | TR2 | EC2 | TX2 | RX2 | RX4 | TX1 | TX4 | RX1 | DOWM | SWCLK | SWDIO | 3.3V | TX3 | RX3 | MOSI | CLK | 22P | 1M | 3V | PE2 | PE1 | PE3 | RESET | PC5 | PC4 | UR_5V | 10k | 8M
